# Altium schematic sheet HV Power Supply.SchDoc
size 333 x 254 mm
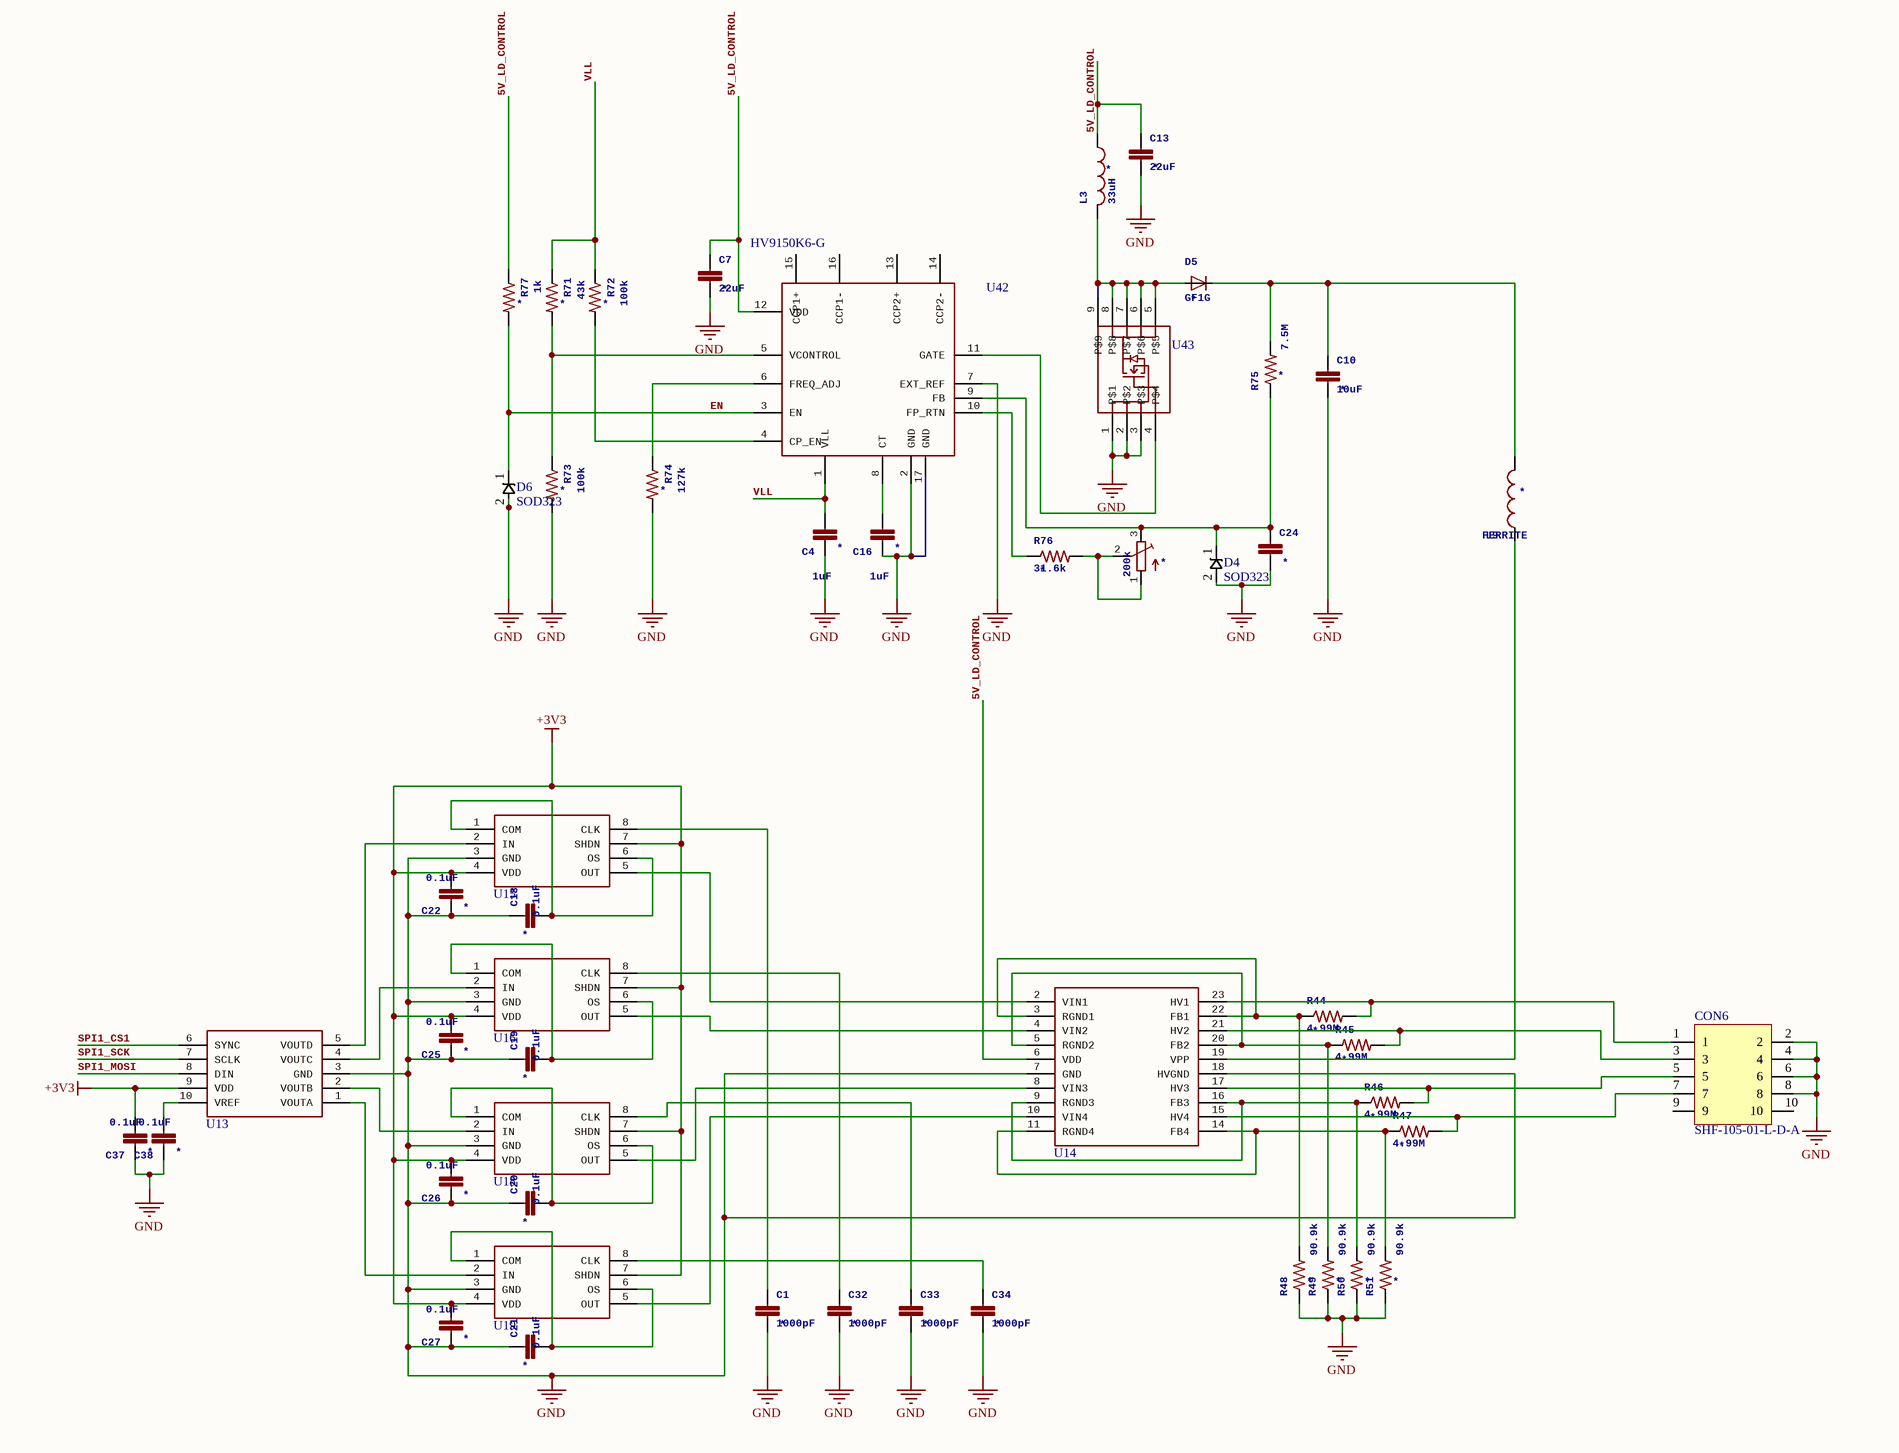
[diagram p0: HV Power Supply.SchDoc]

## Parts
C1  1000pF  [0402 B]
C4  1uF  [0603]
C7  22uF  [0603]
C10  10uF  [C1812]
C13  22uF  [0603]
C16  1uF  [0603]
C18  0.1uF  [0402 B]
C19  0.1uF  [0402 B]
C20  0.1uF  [0402 B]
C21  0.1uF  [0402 B]
C22  0.1uF  [0402 B]
C24  C-EUC0603  [0603]  (value not drawn)
C25  0.1uF  [0402 B]
C26  0.1uF  [0402 B]
C27  0.1uF  [0402 B]
C32  1000pF  [0402 B]
C33  1000pF  [0402 B]
C34  1000pF  [0402 B]
C37  0.1uF  [0402 B]
C38  0.1uF  [0402 B]
CON6  SHF-105-01-L-D-A  [SHF-105-01-L-D-RA]
D4  SOD323  [SOD-323]
D5  GF1G  [DO-214BA]
D6  SOD323  [SOD-323]
L3  33uH  [L1812]
L9  FERRITE  [0603]
R44  4.99M  [0603R]
R45  4.99M  [0603R]
R46  4.99M  [0603R]
R47  4.99M  [0603R]
R48  90.9k  [0603R]
R49  90.9k  [0603R]
R50  90.9k  [0603R]
R51  90.9k  [0603R]
R71  43k  [0603R]
R72  100k  [0603R]
R73  100k  [0603R]
R74  127k  [0603R]
R75  7.5M  [1206R]
R76  31.6k  [0603R]
R77  1k  [0603R]
U13  AD5664R  [MSOP-10]  (value not drawn)
U14  HV264TS-G  [TSSOP-24]  (value not drawn)
U15  MAX7413  [uMAX-8]  (value not drawn)
U16  MAX7413  [uMAX-8]  (value not drawn)
U18  MAX7413  [uMAX-8]  (value not drawn)
U19  MAX7413  [uMAX-8]  (value not drawn)
U42  HV9150K6-G  [QFN-16]
U43  BSZ42DN25NS3GATMA1  [TDSON-8]  (value not drawn)
U44  200k  [TC33X]

## Nets
+3V3: C22.2 C25.2 C26.2 C27.2 C37.2 U13.9(VDD) U15.4(VDD) U15.7(SHDN) U16.4(VDD) U16.7(SHDN) U18.4(VDD) U18.7(SHDN) U19.4(VDD) U19.7(SHDN)
GND: C1.2 C4.1 C7.2 C10.2 C13.2 C16.1 C18.1 C19.1 C20.1 C21.1 C22.1 C24.2 C25.1 C26.1 C27.1 C32.2 C33.2 C34.2 C37.1 C38.1 CON6.2 CON6.4 CON6.6 CON6.8 D4.2 D6.2 R48.1 R49.1 R50.1 R51.1 R73.2 R74.2 U13.3(GND) U14.7(GND) U14.18(HVGND) U15.3(GND) U16.3(GND) U18.3(GND) U19.3(GND) U42.2(GND) U42.7(EXT_REF) U42.17(GND) U43.1(P$1) U43.2(P$2) U43.3(P$3)
5V_LD_CONTROL: C7.1 C13.1 L3.1 R77.1 U14.6(VDD) U42.12(VDD)
EN: D6.1 R77.2 U42.3(EN)
SPI1_CS1: U13.6(SYNC)
SPI1_MOSI: U13.8(DIN)
SPI1_SCK: U13.7(SCLK)
VLL: C4.2 R71.1 R72.1 U42.1(VLL)
NetC1_1: C1.1 U15.8(CLK)
NetC10_1: C10.1 D5.2 L9.2 R75.2
NetC16_2: C16.2 U42.8(CT)
NetC18_2: C18.2 U15.1(COM) U15.6(OS)
NetC19_2: C19.2 U16.1(COM) U16.6(OS)
NetC20_2: C20.2 U18.1(COM) U18.6(OS)
NetC21_2: C21.2 U19.1(COM) U19.6(OS)
NetC24_1: C24.1 D4.1 R75.1 U42.9(FB) U44.3(E)
NetC32_1: C32.1 U16.8(CLK)
NetC33_1: C33.1 U18.8(CLK)
NetC34_1: C34.1 U19.8(CLK)
NetC38_2: C38.2 U13.10(VREF)
NetCON6_1: CON6.1 R44.2 U14.23(HV1)
NetCON6_3: CON6.3 R45.2 U14.21(HV2)
NetCON6_5: CON6.5 R46.2 U14.17(HV3)
NetCON6_7: CON6.7 R47.2 U14.15(HV4)
NetD5_1: D5.1 L3.2 U43.5(P$5) U43.6(P$6) U43.7(P$7) U43.8(P$8) U43.9(P$9)
NetL9_1: L9.1 U14.19(VPP)
NetR44_1: R44.1 R48.2 U14.3(RGND1) U14.22(FB1)
NetR45_1: R45.1 R49.2 U14.5(RGND2) U14.20(FB2)
NetR46_1: R46.1 R50.2 U14.9(RGND3) U14.16(FB3)
NetR47_1: R47.1 R51.2 U14.11(RGND4) U14.14(FB4)
NetR71_2: R71.2 R73.1 U42.5(VCONTROL)
NetR72_2: R72.2 U42.4(CP_EN)
NetR74_1: R74.1 U42.6(FREQ_ADJ)
NetR76_1: R76.1 U42.10(FP_RTN)
NetR76_2: R76.2 U44.1(A) U44.2(S)
NetU13_1: U13.1(VOUTA) U19.2(IN)
NetU13_2: U13.2(VOUTB) U18.2(IN)
NetU13_4: U13.4(VOUTC) U16.2(IN)
NetU13_5: U13.5(VOUTD) U15.2(IN)
NetU14_2: U14.2(VIN1) U15.5(OUT)
NetU14_4: U14.4(VIN2) U16.5(OUT)
NetU14_8: U14.8(VIN3) U18.5(OUT)
NetU14_10: U14.10(VIN4) U19.5(OUT)
NetU42_11: U42.11(GATE) U43.4(P$4)

Not connected (* = marked no-connect by the designer): CON6 9 10; U42 13(CCP2+) 14(CCP2-) 15(CCP1+) 16(CCP1-)

## Library data of the parts
C1 C18-C22 C25-C27 C32-C34 C37 C38 = CAP_0402: 0402 (1005 Metric) Nick Garner - TeleSense; GateName_1: G$1; SymbolName_1: CAP; LibraryName: Perfect_0402; DeviceSetName: CAP_0402; NAME: *
C4 C7 C13 C16 C24 = C-EUC0603: CAPACITOR, European symbol; GateName_1: G$1; SymbolName_1: C-EU; DeviceName: C0603; LibraryName: rcl; DeviceSetName: C-EU; NAME: *
C10 = C-EUC1812: CAPACITOR, European symbol; GateName_1: G$1; SymbolName_1: C-EU; DeviceName: C1812; LibraryName: rcl; DeviceSetName: C-EU; NAME: *
D5 = GF1: DIODE; GateName_1: D; SymbolName_1: D-1; LibraryName: diode; DeviceSetName: GF1; NAME: *
L3 = L-USL1812: INDUCTOR, American symbol; GateName_1: G$1; SymbolName_1: L-US; DeviceName: L1812; LibraryName: resistor; DeviceSetName: L-US; NAME: *
L9 = INDUCTOR30OHM,1.8A: InductorsBasic Inductor/Choke - 0603 and 1206. Footprints are not proven and vary greatly between part numbers.SRN6045- 33uH, 20% 1.4ASDR0403-560KL - 56uH, 10%, 500mA RMS/740mA peak; GateName_1: G$1; PROD_ID: RES-07859; SymbolName_1: INDUCTOR; DeviceName: 30OHM,1.8A; LibraryName: SparkFun-Passives; DeviceSetName: INDUCTOR; NAME: *
R44-R51 R71-R74 R76 R77 = R-US_R0603: RESISTOR, American symbol; GateName_1: G$1; SymbolName_1: R-US; DeviceName: R0603; DeviceSetName: R-US_; LibraryName: rcl; NAME: *
R75 = R-US_R1206: RESISTOR, American symbol; GateName_1: G$1; SymbolName_1: R-US; DeviceName: R1206; DeviceSetName: R-US_; LibraryName: rcl; NAME: *
U13 = AD5664R: GateName_1: G$1; SymbolName_1: AD5664R; LibraryName: custom; DeviceSetName: AD5664R
U14 = HV264: GateName_1: G$1; SymbolName_1: HV264; LibraryName: custom; DeviceSetName: HV264
U15 U16 U18 U19 = MAX7413: GateName_1: G$1; SymbolName_1: MAX7413; LibraryName: custom; DeviceSetName: MAX7413
U42 = HV9150: GateName_1: G$1; SymbolName_1: HV9150; LibraryName: custom; DeviceSetName: HV9150
U43 = BSZ42DN25NS3: GateName_1: G$1; SymbolName_1: BSZ42DN25NS3; LibraryName: custom; DeviceSetName: BSZ42DN25NS3
U44 = TRIMPOTTC33X: SMT trimmer potentiometer part number TC33X http://www.ladyada.net/library/eagle; GateName_1: G$1; SymbolName_1: TRIMPOT; DeviceName: TC33X; LibraryName: adafruit; DeviceSetName: TRIMPOT; NAME: *